# Altium project yard-ice.PrjPCB
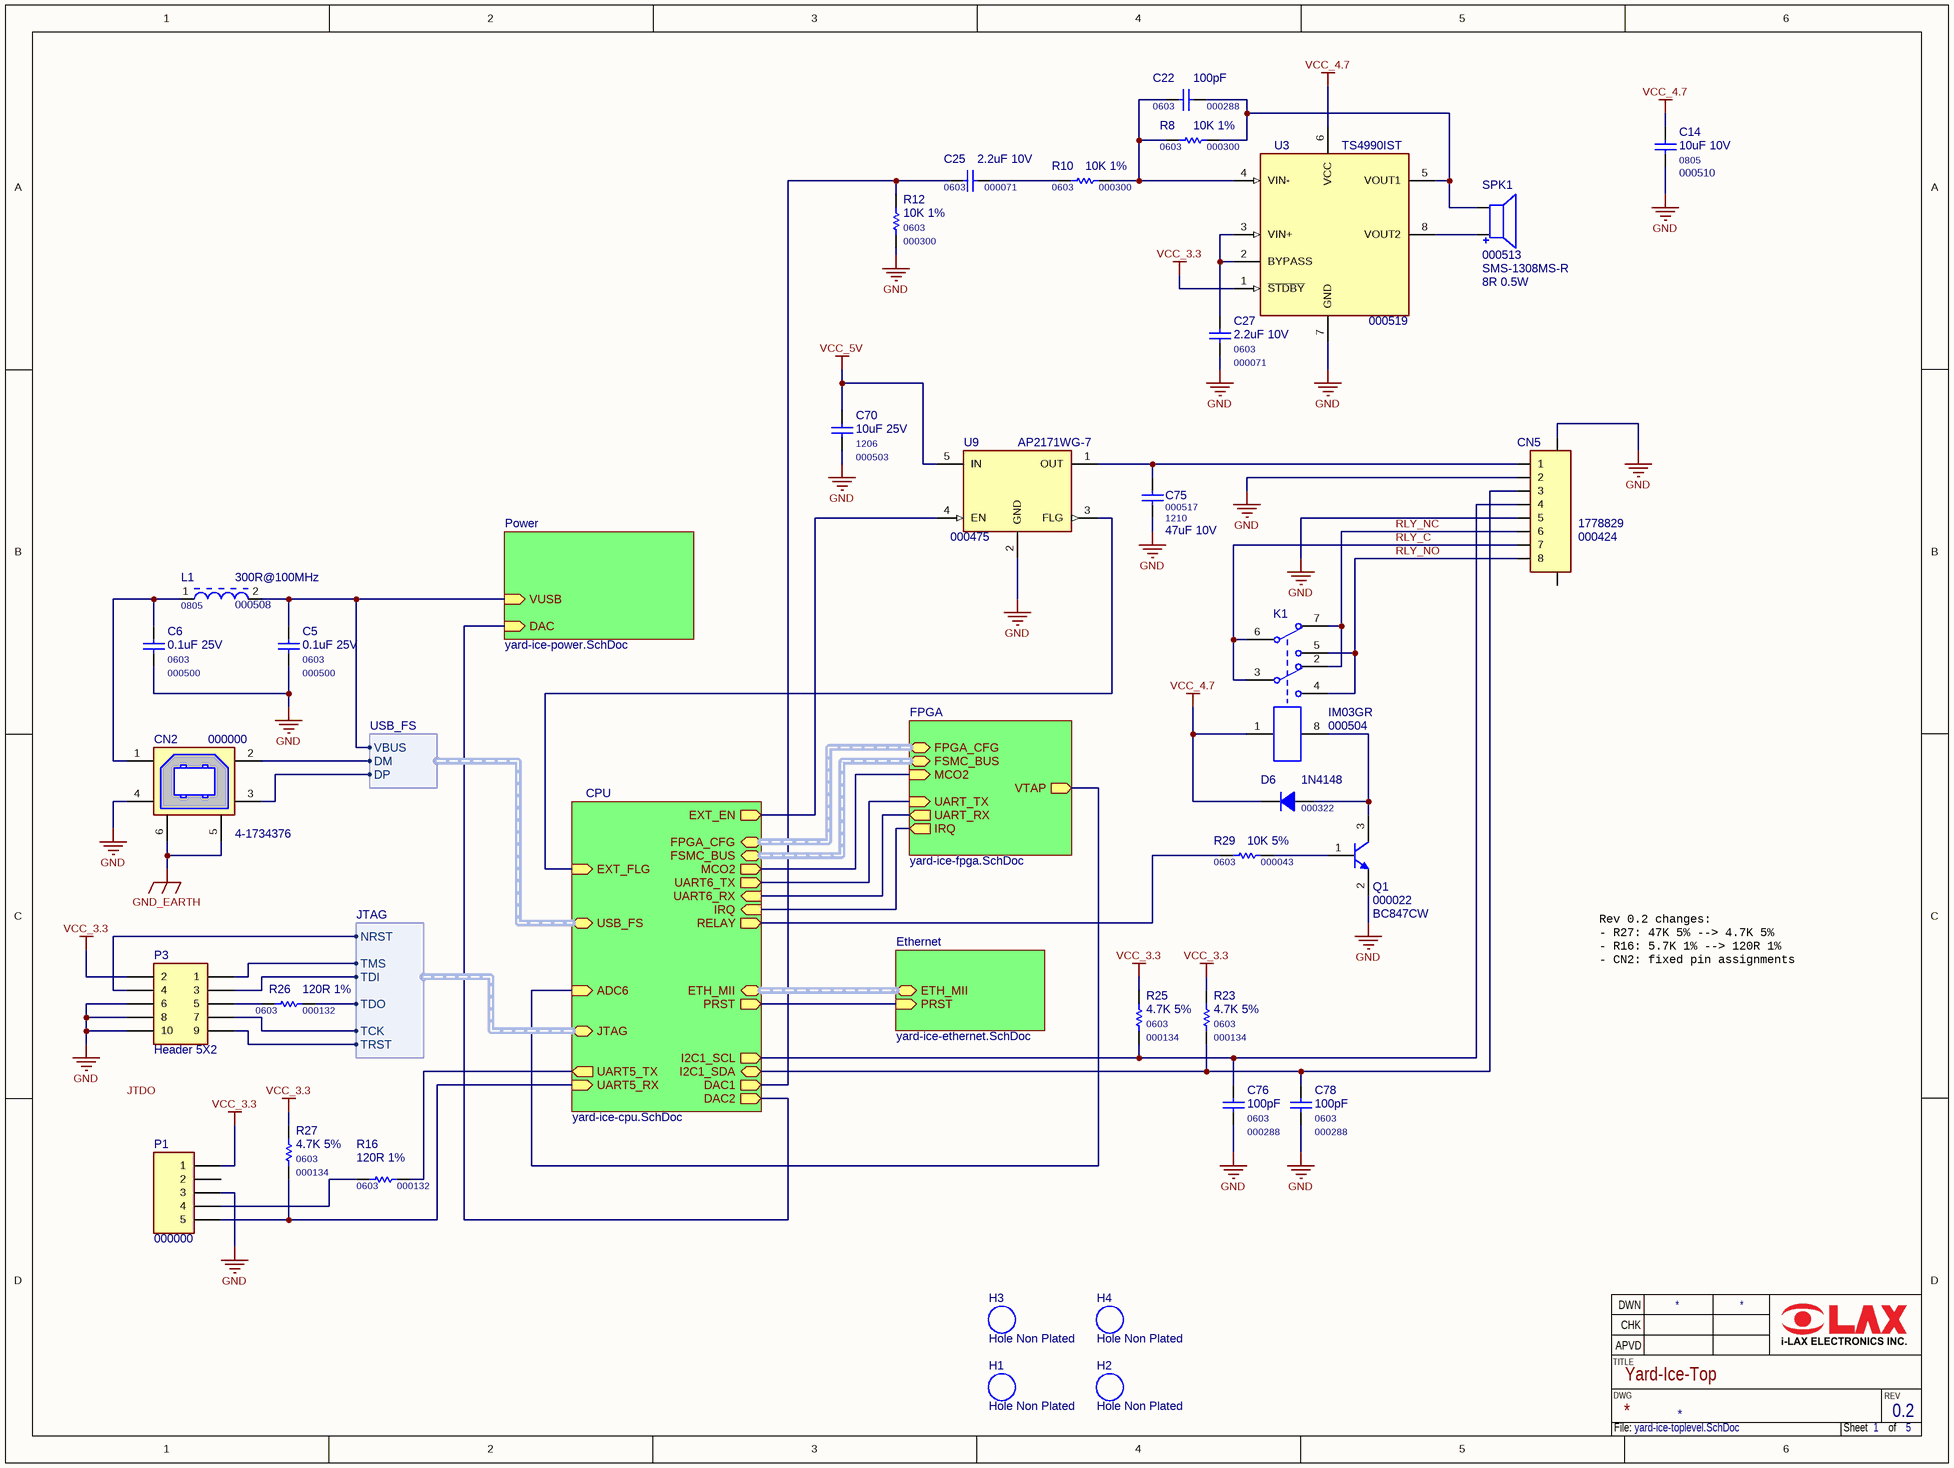
[diagram p0: yard-ice-toplevel.SchDoc]
4 sheets, 143 parts. Net scope: hierarchical (ports join the sheet entries above them; power ports are global).
Board file: yard-ice.PcbDoc
Sheets:
  yard-ice-toplevel.SchDoc
    Power = yard-ice-power.SchDoc
    FPGA = yard-ice-fpga.SchDoc
    Ethernet = yard-ice-ethernet.SchDoc

## Sheet yard-ice-toplevel.SchDoc: Yard-Ice-Top
size 365 x 274 mm; Revision: 0.2; SheetNumber: 1; SheetTotal: 5

### Parts
C5  000500  value 0.1uF 25V  Package: 0603  [C0603M]
C6  000500  value 0.1uF 25V  Package: 0603  [C0603M]
C14  000510  value 10uF 10V  Package: 0805  [C0805M]
C22  000288  value 100pF  Package: 0603  [C0603M]
C25  000071  value 2.2uF 10V  Package: 0603  [C0603M]
C27  000071  value 2.2uF 10V  Package: 0603  [C0603M]
C70  000503  value 10uF 25V  Package: 1206  [C1206M]
C75  000517  value 47uF 10V  Package: 1210  [C1210M]
C76  000288  value 100pF  Package: 0603  [C0603M]
C78  000288  value 100pF  Package: 0603  [C0603M]
CN2  000000  value 4-1734376  [4-1734376]
CN5  000424  value 1778829  [1778829]
D6  000322  value 1N4148  [SOD-123]
H1  Hole Non Plated  [Hole NP 3.2x5.0x5.0]
H2  Hole Non Plated  [Hole NP 3.2x5.0x5.0]
H3  Hole Non Plated  [Hole NP 3.2x5.0x5.0]
H4  Hole Non Plated  [Hole NP 3.2x5.0x5.0]
K1  000504  value IM03GR  [Relay-10X6]
L1  000508  value 300R@100MHz  Package: 0805  [L0805M]
P1  000000  [TSW-105-07-G-S]
P3  Header 5X2  [TSW-105-07-G-D]
Q1  000022  value BC847CW  [SOT-323]
R8  000300  value 10K 1%  Package: 0603  [R0603M]
R10  000300  value 10K 1%  Package: 0603  [R0603M]
R12  000300  value 10K 1%  Package: 0603  [R0603M]
R16  000132  value 120R 1%  Package: 0603  [R0603M]
R23  000134  value 4.7K 5%  Package: 0603  [R0603M]
R25  000134  value 4.7K 5%  Package: 0603  [R0603M]
R26  000132  value 120R 1%  Package: 0603  [R0603M]
R27  000134  value 4.7K 5%  Package: 0603  [R0603M]
R29  000043  value 10K 5%  Package: 0603  [R0603M]
SPK1  000513  value 8R 0.5W  [SMS-1308MS-R]
U3  000519  value TS4990IST  [MiniSO-8M]
U9  000475  value AP2171WG-7  [SOT-25]

### Sub-sheets
CPU = yard-ice-cpu.SchDoc (file not in this document): ETH_MII (harness ETH_MII), FSMC_BUS (harness FSMC_BUS), FPGA_CFG (harness FPGA_CFG), PRST (out), MCO2 (out), USB_FS (harness USB_FS), JTAG (harness JTAG), EXT_EN (out), EXT_FLG (in), ADC6 (in), DAC2 (out), I2C1_SDA (bidir), I2C1_SCL (out), UART6_TX (out), UART6_RX (in), UART5_TX (out), UART5_RX (in), RELAY (out), IRQ (in), DAC1 (out)
Ethernet = yard-ice-ethernet.SchDoc: ETH_MII (harness ETH_MII), PRST (in)
FPGA = yard-ice-fpga.SchDoc: FSMC_BUS (harness FSMC_BUS), FPGA_CFG (harness FPGA_CFG), MCO2 (in), VTAP (out), UART_TX (in), UART_RX (out), IRQ (out)
Power = yard-ice-power.SchDoc: VUSB (in), DAC (in)

### Harnesses
USB_FS: VBUS, DM, DP
JTAG: TDO, TDI, TCK, TMS, TRST, NRST

### Nets
GND: C5.2 C6.2 C14.2 C27.2 C70.2 C75.2 C76.2 C78.2 CN2.4 CN5.2 CN5.5 CN5.9 P1.3 P3.6 P3.8 P3.10 Q1.2(E) R12.1 U3.7(GND) U9.2(GND)
GND_EARTH: CN2.5(SHIELD) CN2.6(SHIELD)
VCC_3.3: P1.1 P3.2 R23.2 R25.2 R27.2 U3.1(~{STDBY})
VCC_4.7: C14.1 D6.2(K) K1.1 U3.6(VCC)
VCC_5V: C70.1 U9.5(IN)
RLY_C: CN5.7 K1.3 K1.6
RLY_NC: CN5.6 K1.2 K1.7
RLY_NO: CN5.8 K1.4 K1.5
NetC5_1: C5.1 L1.2 ; sheet Power/VUSB, sheet CPU/USB_FS.VBUS
NetC6_1: C6.1 CN2.1 L1.1
NetC22_1: C22.1 R8.2 R10.1 U3.4(VIN-)
NetC22_2: C22.2 R8.1 SPK1.2 U3.5(VOUT1)
NetC25_1: C25.1 R12.2 ; sheet CPU/DAC1
NetC25_2: C25.2 R10.2
NetC27_1: C27.1 U3.2(BYPASS) U3.3(VIN+)
NetC69_1: sheet Power/DAC, sheet CPU/DAC2
NetC72_1: sheet CPU/ADC6, sheet FPGA/VTAP
NetC75_1: C75.1 CN5.1 U9.1(OUT)
NetC76_1: C76.1 CN5.4 R25.1 ; sheet CPU/I2C1_SCL
NetC78_1: C78.1 CN5.3 R23.1 ; sheet CPU/I2C1_SDA
NetCN2_2: CN2.2 ; sheet CPU/USB_FS.DM
NetCN2_3: CN2.3 ; sheet CPU/USB_FS.DP
NetD6_1: D6.1(A) K1.8 Q1.3(C)
NetP1_4: P1.4 R16.2
NetP1_5: P1.5 R27.1 ; sheet CPU/UART5_RX
NetP3_1: P3.1 ; sheet CPU/JTAG.TMS
NetP3_3: P3.3 ; sheet CPU/JTAG.TDI
NetP3_4: P3.4 ; sheet CPU/JTAG.NRST
NetP3_5: P3.5 R26.1
NetP3_7: P3.7 ; sheet CPU/JTAG.TCK
NetP3_9: P3.9 ; sheet CPU/JTAG.TRST
NetQ1_1: Q1.1(B) R29.1
NetR16_1: R16.1 ; sheet CPU/UART5_TX
NetR26_2: R26.2 ; sheet CPU/JTAG.TDO
NetR28_2: sheet CPU/MCO2, sheet FPGA/MCO2
NetR29_2: R29.2 ; sheet CPU/RELAY
NetSPK1_1: SPK1.1 U3.8(VOUT2)
NetU4_47: sheet CPU/PRST, sheet Ethernet/PRST
NetU7_51: sheet CPU/UART6_RX, sheet FPGA/UART_RX
NetU7_52: sheet CPU/UART6_TX, sheet FPGA/UART_TX
NetU7_53: sheet CPU/IRQ, sheet FPGA/IRQ
NetU9_3: U9.3(FLG) ; sheet CPU/EXT_FLG
NetU9_4: U9.4(EN) ; sheet CPU/EXT_EN

Not connected (* = marked no-connect by the designer): CN5 10; P1 2

### Buses and harness runs
harness sheet CPU/ETH_MII = sheet Ethernet/ETH_MII
harness sheet CPU/FPGA_CFG = sheet FPGA/FPGA_CFG
harness sheet CPU/FSMC_BUS = sheet FPGA/FSMC_BUS

### Notes on the sheet
- Rev 0.2 changes:
  - R27: 47K 5% --> 4.7K 5%
  - R16: 5.7K 1% --> 120R 1%
  - CN2: fixed pin assignments
- Labels drawn without touching a wire or pin: JTDO
- TITLE
- APVD
- DWN
- CHK
- DWG
- REV
- File:
- Sheet
- of

### Library data of the parts
C5 C6 = C0603: SMD Ceramic Chip Capacitor - 0603 - X7R; MF PN: C1608X7R1E104K; MF: TDK; PN: 000500
C14 = C0805: SMD Ceramic Chip Capacitor - 0805 - X7R; MF PN: C2012X7R1A106K; MF: TDK; PN: 000510
C22 C76 C78 = C0603: SMD Ceramic Chip Capacitor - 0603; PN: 000288
C25 = C0603: SMD Ceramic Chip Capacitor - 0603 - X7R; MF PN: LMK107B7225KA-T; MF: Taiyo Yuden; PN: 000071
C27 = C0603: SMD Ceramic Chip Capacitor - 0603 - X7R; MF: Taiyo Yuden; MF PN: LMK107B7225KA-T; PN: 000071
C70 = C1206: SMD Ceramic Chip Capacitor - 1206 - X7R; MF PN: TMK316B7106KL-TD; MF: Taiyo Yuden; PN: 000503
C75 = C12010: SMD Ceramic Chip Capacitor - 1210 - X7R; MF: Taiyo Yuden; MF PN: LMK325B7476MM-TR; PN: 000517
CN2 = 4-1734376: USB Type B - Right Angle - Thru Hole; MF: Tyco; PN: 000000; Package: PTH
CN5 = Combicon SMT 8: Terminal Block, Header, 8-Pos; MF: Phoenix Contacts; PN: 000424; Package: SMT
D6 = 1N4148W: Schottky Barrier Diode; MF: Diodes Inc; MF PN: 1N4148W-7-F; PN: 000322; Package: SOD-123
K1 = Relay-DPDT: Dual-Pole Dual-Throw Relay; MF: Tyco; PN: 000504; Package: SMT; MF PN: IM03GR
L1 = L0805: SMD Chip Inductor - 0805; MF PN: MMZ2012Y301B; MF: TDK; PN: 000508
P1 = Header 5: Header, 5-Pin; Value: 5x1; PN: 000000; Package: PTH
P3 = Header 5X2: Header 5-Pin, Dual row; PN: 000000; Package: PTH; Value: 5x2
Q1 = BC847CW: NPN General-purpose Transistor; MF: Diodes Inc; MF PN: BC847CW-7-F; PN: 000022; Package: SOT-323
R8 R10 R12 R16 R23 R25-R27 R29 = R0603: SMD Chip Resistor - 0603
  R8 R10 R12: PN: 000300
  R16 R26: PN: 000132
  R23 R25 R27: PN: 000134
  R29: PN: 000043
SPK1 = SMS-1308MS-R: Loudspeaker; MF: PUI-Audio; PN: 000513; Package: SMT; MF PN: SMS-1308MS-R
U3 = TS4990IST: 1.2 W audio power amplifier with active-low standby mode; PN: 000519; Package: TSSOP-8
U9 = AP2171W: 1A SINGLE CHANNEL CURRENT-LIMITED POWER  SWITCH; MF: Diodes Inc; Package: SOT23-5; PN: 000475

## Sheet yard-ice-power.SchDoc: Yard-Ice-Power
size 365 x 274 mm; Revision: 0.2; SheetNumber: 2; SheetTotal: 5
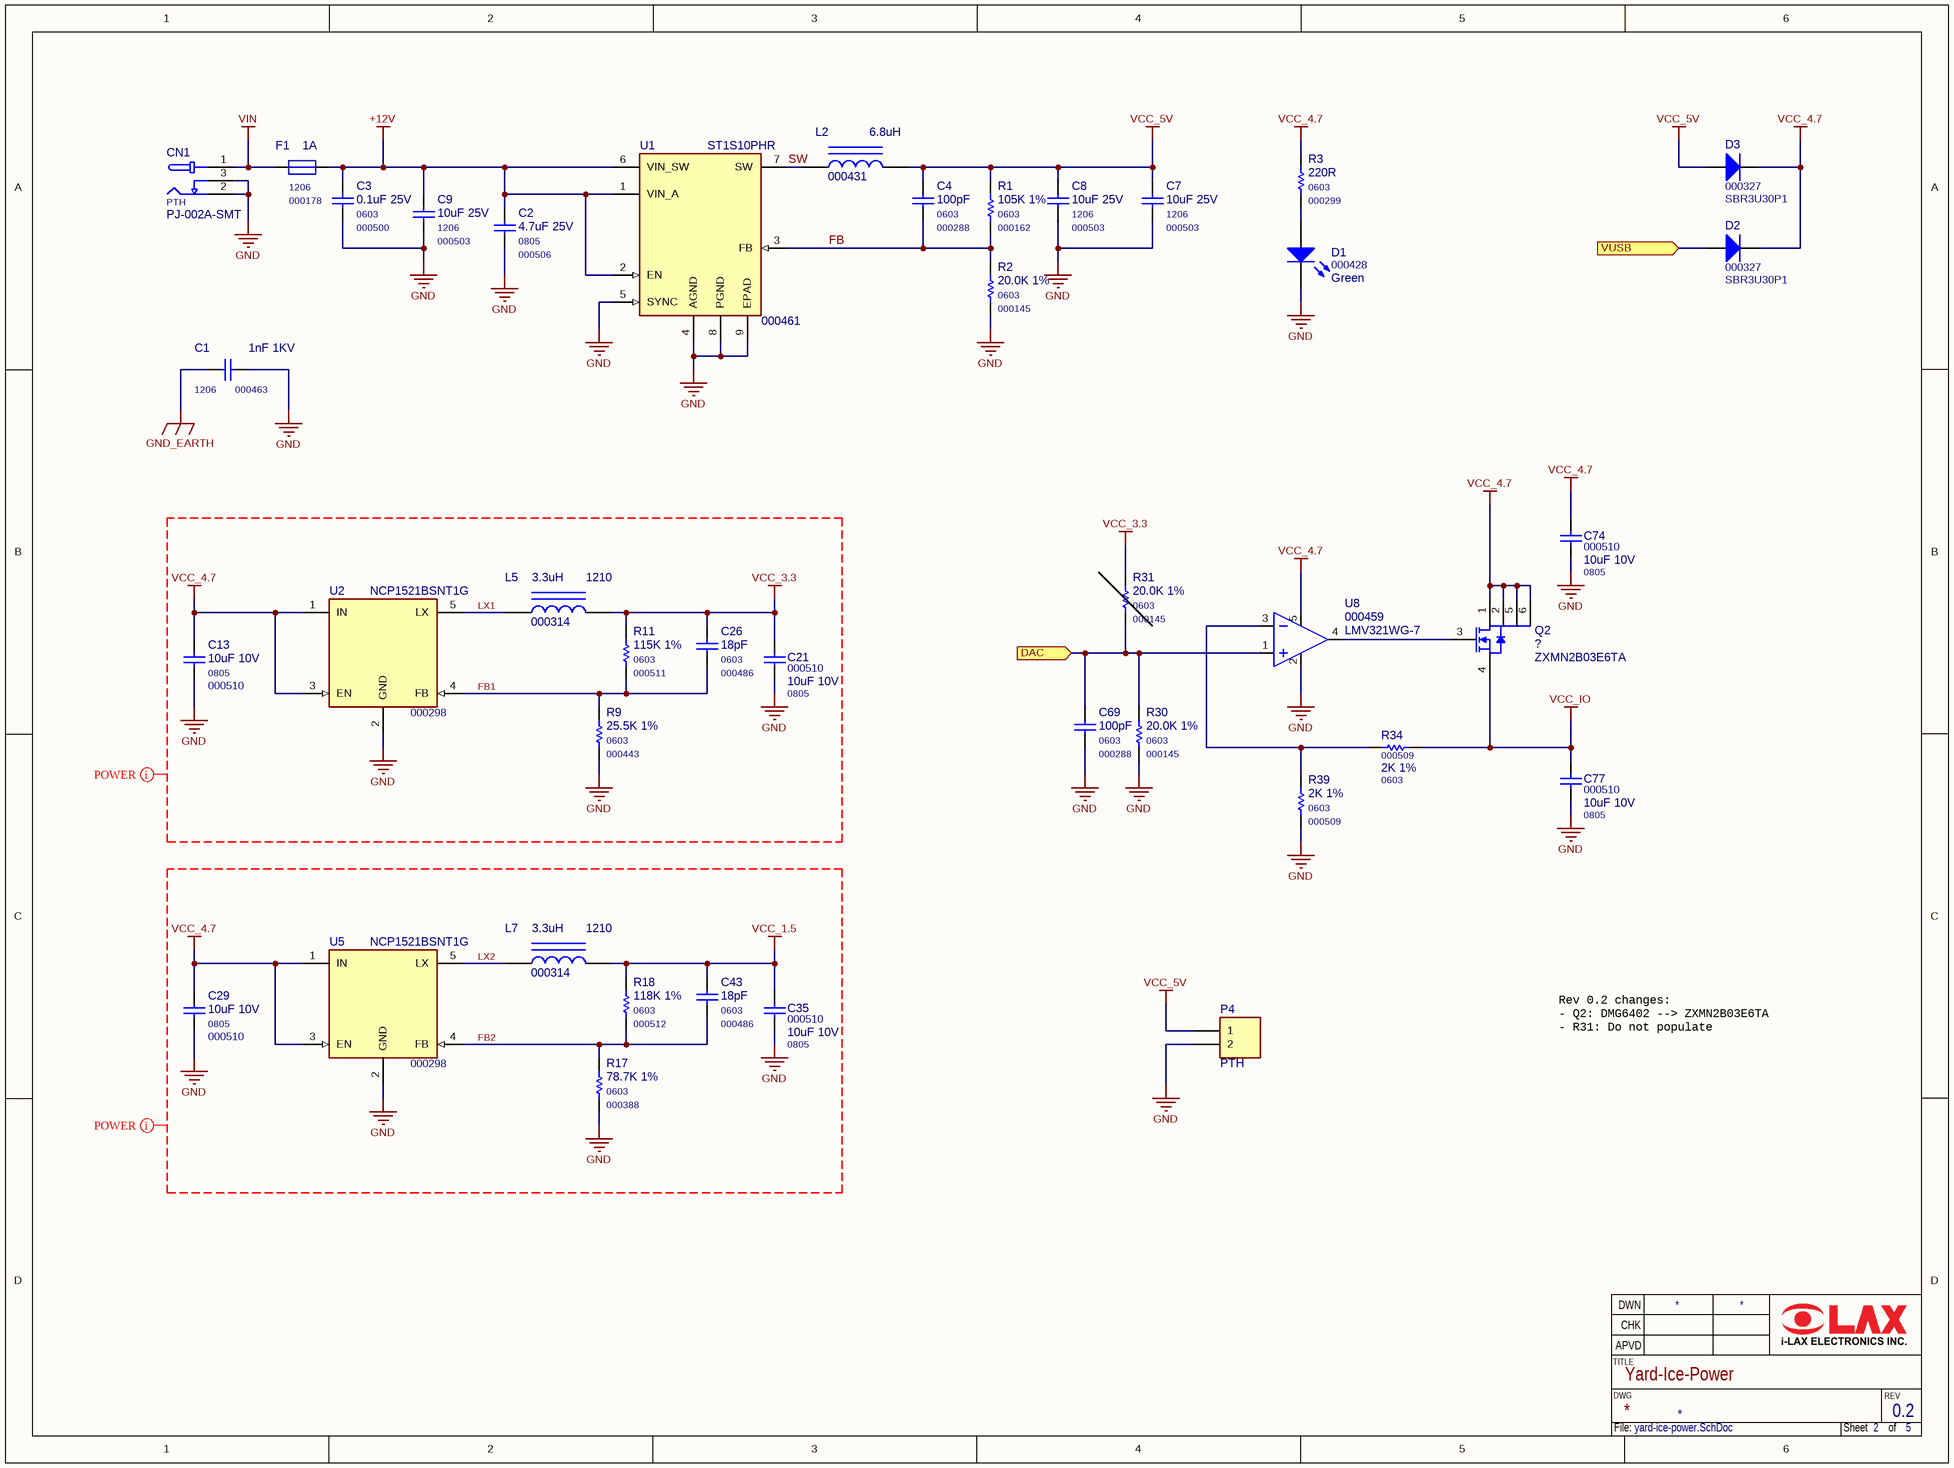
[diagram p1: yard-ice-power.SchDoc]

### Parts
C1  000463  value 1nF 1KV  Package: 1206  [C1206M]
C2  000506  value 4.7uF 25V  Package: 0805  [C0805M]
C3  000500  value 0.1uF 25V  Package: 0603  [C0603M]
C4  000288  value 100pF  Package: 0603  [C0603M]
C7  000503  value 10uF 25V  Package: 1206  [C1206M]
C8  000503  value 10uF 25V  Package: 1206  [C1206M]
C9  000503  value 10uF 25V  Package: 1206  [C1206M]
C13  000510  value 10uF 10V  Package: 0805  [C0805M]
C21  000510  value 10uF 10V  Package: 0805  [C0805M]
C26  000486  value 18pF  Package: 0603  [C0603M]
C29  000510  value 10uF 10V  Package: 0805  [C0805M]
C35  000510  value 10uF 10V  Package: 0805  [C0805M]
C43  000486  value 18pF  Package: 0603  [C0603M]
C69  000288  value 100pF  Package: 0603  [C0603M]
C74  000510  value 10uF 10V  Package: 0805  [C0805M]
C77  000510  value 10uF 10V  Package: 0805  [C0805M]
CN1  PTH  [PJ-002A-SMT]
D1  000428  value Green  [LED0805L LP]
D2  000327  value SBR3U30P1  [PowerDI 123]
D3  000327  value SBR3U30P1  [PowerDI 123]
F1  000178  value 1A  Package: 1206  [F1206L]
L2  000431  value 6.8uH  [L8.0MMX8.0MM]
L5  000314  value 3.3uH  Package: 1210  [L1210M]
L7  000314  value 3.3uH  Package: 1210  [L1210M]
P4  PTH  [TSW-102-07-G-S]
Q2  ?  value ZXMN2B03E6TA  [SOT-26]
R1  000162  value 105K 1%  Package: 0603  [R0603M]
R2  000145  value 20.0K 1%  Package: 0603  [R0603M]
R3  000299  value 220R  Package: 0603  [R0603M]
R9  000443  value 25.5K 1%  Package: 0603  [R0603M]
R11  000511  value 115K 1%  Package: 0603  [R0603M]
R17  000388  value 78.7K 1%  Package: 0603  [R0603M]
R18  000512  value 118K 1%  Package: 0603  [R0603M]
R30  000145  value 20.0K 1%  Package: 0603  [R0603M]
R31  000145  value 20.0K 1%  Package: 0603  [R0603M]
R34  000509  value 2K 1%  Package: 0603  [R0603M]
R39  000509  value 2K 1%  Package: 0603  [R0603M]
U1  000461  value ST1S10PHR  [PowerSO-8]
U2  000298  value NCP1521BSNT1G  [TSOP-5]
U5  000298  value NCP1521BSNT1G  [TSOP-5]
U8  000459  value LMV321WG-7  [SOT-25]

### Ports
DAC (in), VUSB (in)

### Nets
+12V: C2.1 C3.1 C9.1 F1.2 U1.1(VIN_A) U1.2(EN) U1.6(VIN_SW)
GND: C1.2 C2.2 C3.2 C7.2 C8.2 C9.2 C13.2 C21.2 C29.2 C35.2 C69.2 C74.2 C77.2 CN1.2 CN1.3 D1.2(K) P4.2 R2.1 R9.1 R17.1 R30.1 R39.1 U1.4(AGND) U1.5(SYNC) U1.8(PGND) U1.9(EPAD) U2.2(GND) U5.2(GND) U8.2(V-)
GND_EARTH: C1.1
VCC_1.5: C35.1 C43.1 L7.2 R18.2
VCC_3.3: C21.1 C26.1 L5.2 R11.2 R31.2
VCC_4.7: C13.1 C29.1 C74.1 D2.2(K) D3.2(K) Q2.1(D) Q2.2(D) Q2.5(D) Q2.6(D) R3.2 U2.1(IN) U2.3(EN) U5.1(IN) U5.3(EN) U8.5(V+)
VCC_5V: C4.1 C7.1 C8.1 D3.1(A) L2.2 P4.1 R1.2
VCC_IO: C77.1 Q2.4(S) R34.1
VIN: CN1.1 F1.1
FB: C4.2 R1.1 R2.2 U1.3(FB)
FB1: C26.2 R9.2 R11.1 U2.4(FB)
FB2: C43.2 R17.2 R18.1 U5.4(FB)
LX1: L5.1 U2.5(LX)
LX2: L7.1 U5.5(LX)
SW: L2.1 U1.7(SW)
NetC5_1: D2.1(A) ; port VUSB
NetC69_1: C69.1 R30.2 R31.1 U8.1(IN+) ; port DAC
NetD1_1: D1.1(A) R3.1
NetQ2_3: Q2.3(G) U8.4(OUT)
NetR34_2: R34.2 R39.2 U8.3(IN-)

### Layout directives
net class POWER: FB1, FB2, GND, LX1, LX2, VCC_1.5, VCC_3.3, VCC_4.7

### Notes on the sheet
- Rev 0.2 changes:
  - Q2: DMG6402 --> ZXMN2B03E6TA
  - R31: Do not populate
- TITLE
- APVD
- DWN
- CHK
- DWG
- REV
- File:
- Sheet
- of

### Library data of the parts
C1 = C1206: SMD Ceramic Chip Capacitor - 1206; PN: 000463
C2 = C0805: SMD Ceramic Chip Capacitor - 0805 - X7R; MF: Taiyo Yuden; MF PN: TMK212AB7475KG-T; PN: 000506
C3 = C0603: as C5 on sheet yard-ice-toplevel; PN: 000500
C4 C26 C43 C69 = C0603: SMD Ceramic Chip Capacitor - 0603
  C4 C69: PN: 000288
  C26 C43: PN: 000486
C7-C9 = C1206: as C70 on sheet yard-ice-toplevel; PN: 000503
C13 C21 C29 C35 = C0805: as C14 on sheet yard-ice-toplevel; PN: 000510
C74 C77 = C0805: SMD Ceramic Chip Capacitor - 0805 - X7R; MF PN: C2012X7R1A106K; PN: TDK; PN: 000510; MF: TDK
CN1 = PJ-002A-SMT: Low Voltage Power Supply Connector; MF: CUI INC; PN: PTH; MF PN: PJ-002A-SMT; Package: SMT; Value: PJ-002A-SMT
D1 = LED0805LP: LED SMD 0805; Package: 0805; PN: 000428
D2 D3 = SBR3U30P1: Super Barrier Rectifier; MF: Diodes Inc; PN: 000327; Package: PowerDI 123
F1 = F1206: SMD Fuse, 1A, Slow, 63VDC, 1206; MF: Bel Fuse Inc; MF PN: C1S 1; PN: 000178
L2 = L8.0X8.0: SMT Power Inductor 8.0X8.0mm; MF: Taiyo Yuden; MF PN: NRS8040T6R8NJGJ; PN: 000431; Package: 8.0x8.0mm
L5 L7 = L1210: SMD Wire Wound Inductor -  1210 (3225 metric); MF: Murata; MF PN: LQH32PN3R3NN0L; PN: 000314
P4 = Header 2: Header, 2-Pin; Value: 2x1; PN: PTH; Package: PTH
Q2 = ZXMN10A08E6: N-Channel MOSFET, 30V, 5.3A; MF: Diodes Inc.; MF PN: DMG6402LDM-7; PN: ?; Package: SOT23-6
R1-R3 R9 R11 R17 R18 R30 R31 R34 R39 = R0603: SMD Chip Resistor - 0603
  R1: PN: 000162
  R2 R30 R31: PN: 000145
  R3: PN: 000299
  R9: PN: 000443
  R11: PN: 000511
  R17: PN: 000388
  R18: PN: 000512
  R34 R39: PN: 000509
U1 = ST1S10: 3A, 900kHZ, monolithic synchronous step-down regulator; MF: ST; PN: 000461; Package: SOIC-8
U2 U5 = NCP1521BSNT1G: 1.5 MHz, 600 mA Step-Down  DC-DC Converter; MF: ON Semiconductor; PN: 000298; Package: SOT-23-5
U8 = LMV321WG-7: General Purpose, Low Voltage, Rail-to-Rail Output Operational Amplifier; MF: Diodes Inc; Package: SOT25; PN: 000459

## Sheet yard-ice-fpga.SchDoc: Yard-Ice-FPGA
size 365 x 274 mm; Revision: 0.2; SheetNumber: 4; SheetTotal: 5
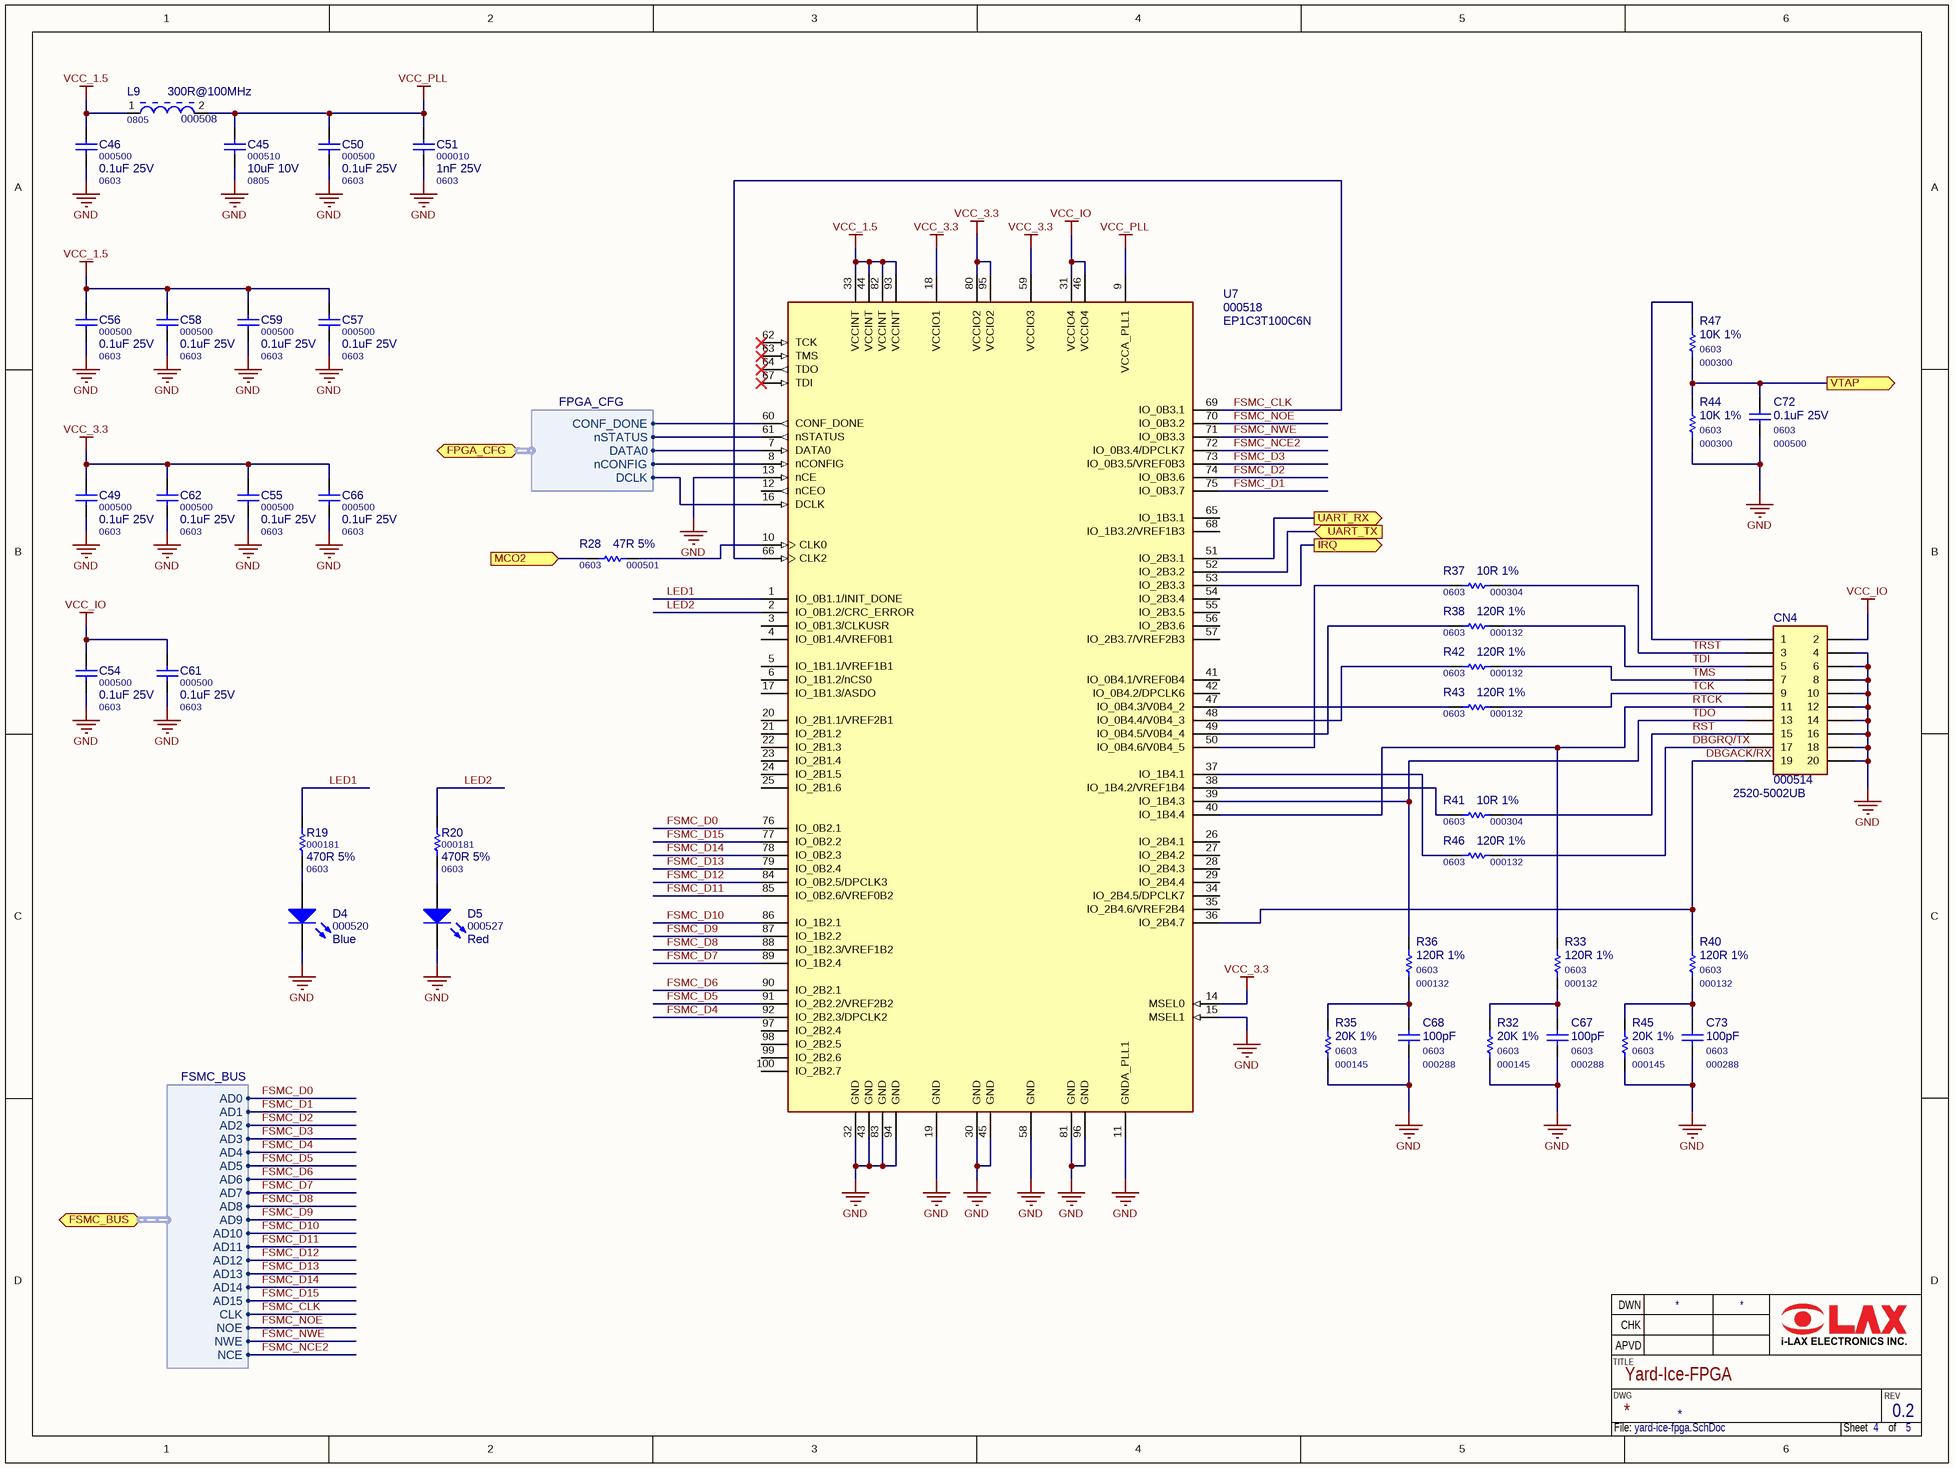
[diagram p2: yard-ice-fpga.SchDoc]

### Parts
C45  000510  value 10uF 10V  Package: 0805  [C0805M]
C46  000500  value 0.1uF 25V  Package: 0603  [C0603M]
C49  000500  value 0.1uF 25V  Package: 0603  [C0603M]
C50  000500  value 0.1uF 25V  Package: 0603  [C0603M]
C51  000010  value 1nF 25V  Package: 0603  [C0603M]
C54  000500  value 0.1uF 25V  Package: 0603  [C0603M]
C55  000500  value 0.1uF 25V  Package: 0603  [C0603M]
C56  000500  value 0.1uF 25V  Package: 0603  [C0603M]
C57  000500  value 0.1uF 25V  Package: 0603  [C0603M]
C58  000500  value 0.1uF 25V  Package: 0603  [C0603M]
C59  000500  value 0.1uF 25V  Package: 0603  [C0603M]
C61  000500  value 0.1uF 25V  Package: 0603  [C0603M]
C62  000500  value 0.1uF 25V  Package: 0603  [C0603M]
C66  000500  value 0.1uF 25V  Package: 0603  [C0603M]
C67  000288  value 100pF  Package: 0603  [C0603M]
C68  000288  value 100pF  Package: 0603  [C0603M]
C72  000500  value 0.1uF 25V  Package: 0603  [C0603M]
C73  000288  value 100pF  Package: 0603  [C0603M]
CN4  000514  value 2520-5002UB  [TST-110-04-G-D-RA]
D4  000520  value Blue  [LED0805L LP]
D5  000527  value Red  [LED0805L LP]
L9  000508  value 300R@100MHz  Package: 0805  [L0805M]
R19  000181  value 470R 5%  Package: 0603  [R0603M]
R20  000181  value 470R 5%  Package: 0603  [R0603M]
R28  000501  value 47R 5%  Package: 0603  [R0603M]
R32  000145  value 20K 1%  Package: 0603  [R0603M]
R33  000132  value 120R 1%  Package: 0603  [R0603M]
R35  000145  value 20K 1%  Package: 0603  [R0603M]
R36  000132  value 120R 1%  Package: 0603  [R0603M]
R37  000304  value 10R 1%  Package: 0603  [R0603M]
R38  000132  value 120R 1%  Package: 0603  [R0603M]
R40  000132  value 120R 1%  Package: 0603  [R0603M]
R41  000304  value 10R 1%  Package: 0603  [R0603M]
R42  000132  value 120R 1%  Package: 0603  [R0603M]
R43  000132  value 120R 1%  Package: 0603  [R0603M]
R44  000300  value 10K 1%  Package: 0603  [R0603M]
R45  000145  value 20K 1%  Package: 0603  [R0603M]
R46  000132  value 120R 1%  Package: 0603  [R0603M]
R47  000300  value 10K 1%  Package: 0603  [R0603M]
U7  000518  value EP1C3T100C6N  [TQFP-100]

### Ports
FPGA_CFG (harness FPGA_CFG), FSMC_BUS (harness FSMC_BUS), IRQ (out), MCO2 (in), UART_RX (out), UART_TX (in), VTAP (out)

### Harnesses
FSMC_BUS: AD0, AD1, AD2, AD3, AD4, AD5, AD6, AD7, AD8, AD9, AD10, AD11, AD12, AD13, AD14, AD15, CLK, NOE, NWE, NCE
FPGA_CFG: CONF_DONE, nSTATUS, DATA0, nCONFIG, DCLK

### Nets
GND: C45.2 C46.2 C49.2 C50.2 C51.2 C54.2 C55.2 C56.2 C57.2 C58.2 C59.2 C61.2 C62.2 C66.2 C67.2 C68.2 C72.2 C73.2 CN4.4 CN4.6 CN4.8 CN4.10 CN4.12 CN4.14 CN4.16 CN4.18 CN4.20 D4.2(K) D5.2(K) R32.2 R35.2 R44.2 R45.2 U7.11(GNDA_PLL1) U7.13(nCE) U7.15(MSEL1) U7.19(GND) U7.30(GND) U7.32(GND) U7.43(GND) U7.45(GND) U7.58(GND) U7.81(GND) U7.83(GND) U7.94(GND) U7.96(GND)
VCC_1.5: C46.1 C56.1 C57.1 C58.1 C59.1 L9.1 U7.33(VCCINT) U7.44(VCCINT) U7.82(VCCINT) U7.93(VCCINT)
VCC_3.3: C49.1 C55.1 C62.1 C66.1 U7.14(MSEL0) U7.18(VCCIO1) U7.59(VCCIO3) U7.80(VCCIO2) U7.95(VCCIO2)
VCC_IO: C54.1 C61.1 CN4.2 U7.31(VCCIO4) U7.46(VCCIO4)
VCC_PLL: C45.1 C50.1 C51.1 L9.2 U7.9(VCCA_PLL1)
DBGACK/RX: CN4.19 R40.1 U7.36(IO_2B4.7)
DBGRQ/TX: CN4.17 R46.1
FSMC_CLK: U7.66(CLK2) U7.69(IO_0B3.1) ; port FSMC_BUS.CLK
FSMC_D0: U7.76(IO_0B2.1) ; port FSMC_BUS.AD0
FSMC_D1: U7.75(IO_0B3.7) ; port FSMC_BUS.AD1
FSMC_D2: U7.74(IO_0B3.6) ; port FSMC_BUS.AD2
FSMC_D3: U7.73(IO_0B3.5/VREF0B3) ; port FSMC_BUS.AD3
FSMC_D4: U7.92(IO_2B2.3/DPCLK2) ; port FSMC_BUS.AD4
FSMC_D5: U7.91(IO_2B2.2/VREF2B2) ; port FSMC_BUS.AD5
FSMC_D6: U7.90(IO_2B2.1) ; port FSMC_BUS.AD6
FSMC_D7: U7.89(IO_1B2.4) ; port FSMC_BUS.AD7
FSMC_D8: U7.88(IO_1B2.3/VREF1B2) ; port FSMC_BUS.AD8
FSMC_D9: U7.87(IO_1B2.2) ; port FSMC_BUS.AD9
FSMC_D10: U7.86(IO_1B2.1) ; port FSMC_BUS.AD10
FSMC_D11: U7.85(IO_0B2.6/VREF0B2) ; port FSMC_BUS.AD11
FSMC_D12: U7.84(IO_0B2.5/DPCLK3) ; port FSMC_BUS.AD12
FSMC_D13: U7.79(IO_0B2.4) ; port FSMC_BUS.AD13
FSMC_D14: U7.78(IO_0B2.3) ; port FSMC_BUS.AD14
FSMC_D15: U7.77(IO_0B2.2) ; port FSMC_BUS.AD15
FSMC_NCE2: U7.72(IO_0B3.4/DPCLK7) ; port FSMC_BUS.NCE
FSMC_NOE: U7.70(IO_0B3.2) ; port FSMC_BUS.NOE
FSMC_NWE: U7.71(IO_0B3.3) ; port FSMC_BUS.NWE
LED1: R19.1 U7.1(IO_0B1.1/INIT_DONE)
LED2: R20.1 U7.2(IO_0B1.2/CRC_ERROR)
RST: CN4.15 R41.1
RTCK: CN4.11 R33.1 U7.40(IO_1B4.4)
TCK: CN4.9 R43.1
TDI: CN4.5 R38.1
TDO: CN4.13 R36.1 U7.39(IO_1B4.3)
TMS: CN4.7 R42.1
TRST: CN4.3 R37.1
NetC67_1: C67.1 R32.1 R33.2
NetC68_1: C68.1 R35.1 R36.2
NetC72_1: C72.1 R44.1 R47.2 ; port VTAP
NetC73_1: C73.1 R40.2 R45.1
NetCN4_1: CN4.1 R47.1
NetD4_1: D4.1(A) R19.2
NetD5_1: D5.1(A) R20.2
NetR28_1: R28.1 U7.10(CLK0)
NetR28_2: R28.2 ; port MCO2
NetR37_2: R37.2 U7.50(IO_0B4.6/V0B4_5)
NetR38_2: R38.2 U7.49(IO_0B4.5/V0B4_4)
NetR41_2: R41.2 U7.38(IO_1B4.2/VREF1B4)
NetR42_2: R42.2 U7.48(IO_0B4.4/V0B4_3)
NetR43_2: R43.2 U7.47(IO_0B4.3/V0B4_2)
NetR46_2: R46.2 U7.37(IO_1B4.1)
NetU7_7: U7.7(DATA0) ; port FPGA_CFG.DATA0
NetU7_8: U7.8(nCONFIG) ; port FPGA_CFG.nCONFIG
NetU7_16: U7.16(DCLK) ; port FPGA_CFG.DCLK
NetU7_51: U7.51(IO_2B3.1) ; port UART_RX
NetU7_52: U7.52(IO_2B3.2) ; port UART_TX
NetU7_53: U7.53(IO_2B3.3) ; port IRQ
NetU7_60: U7.60(CONF_DONE) ; port FPGA_CFG.CONF_DONE
NetU7_61: U7.61(nSTATUS) ; port FPGA_CFG.nSTATUS

Not connected (* = marked no-connect by the designer): U7 3(IO_0B1.3/CLKUSR) 4(IO_0B1.4/VREF0B1) 5(IO_1B1.1/VREF1B1) 6(IO_1B1.2/nCS0) 12(nCEO) 17(IO_1B1.3/ASDO) 20(IO_2B1.1/VREF2B1) 21(IO_2B1.2) 22(IO_2B1.3) 23(IO_2B1.4) 24(IO_2B1.5) 25(IO_2B1.6) 26(IO_2B4.1) 27(IO_2B4.2) 28(IO_2B4.3) 29(IO_2B4.4) 34(IO_2B4.5/DPCLK7) 35(IO_2B4.6/VREF2B4) 41(IO_0B4.1/VREF0B4) 42(IO_0B4.2/DPCLK6) 54(IO_2B3.4) 55(IO_2B3.5) 56(IO_2B3.6) 57(IO_2B3.7/VREF2B3) 62(TCK)* 63(TMS)* 64(TDO)* 65(IO_1B3.1) 67(TDI)* 68(IO_1B3.2/VREF1B3) 97(IO_2B2.4) 98(IO_2B2.5) 99(IO_2B2.6) 100(IO_2B2.7)

### Notes on the sheet
- TITLE
- APVD
- DWN
- CHK
- DWG
- REV
- File:
- Sheet
- of

### Library data of the parts
C45 = C0805: as C14 on sheet yard-ice-toplevel; PN: 000510
C46 C49 C50 C54-C59 C61 C62 C66 C72 = C0603: as C5 on sheet yard-ice-toplevel; PN: 000500
C51 = C0603: SMD Ceramic Chip Capacitor - 0603 - X7R; PN: 000010
C67 C68 C73 = C0603: SMD Ceramic Chip Capacitor - 0603; PN: 000288
CN4 = Header 10X2: Shrouded Header, 20 Pos, Right Angle; MF: 3M; PN: 000514; Package: PTH; MF PN: 2520-5002UB
D4 D5 = LED0805LP: LED SMD 0805; Package: 0805
  D4: PN: 000520
  D5: PN: 000527
L9 = L0805: SMD Ferrite Bead 0805; MF PN: MMZ2012Y301B; MF: TDK; PN: 000508
R19 R20 R28 R32 R33 R35-R38 R40-R47 = R0603: SMD Chip Resistor - 0603
  R19 R20: PN: 000181
  R28: PN: 000501
  R32 R35 R45: PN: 000145
  R33 R36 R38 R40 R42 R43 R46: PN: 000132
  R37 R41: PN: 000304
  R44 R47: PN: 000300
U7 = EP1C3T100C8N: Cyclone FPGA; MF: Altera; Package: 100-TQFP; PN: 000518; MF PN: EP1C3T100C6N

## Sheet yard-ice-ethernet.SchDoc: Yard-Ice-Ethernet
size 365 x 274 mm; Revision: 0.2; SheetNumber: 5; SheetTotal: 5
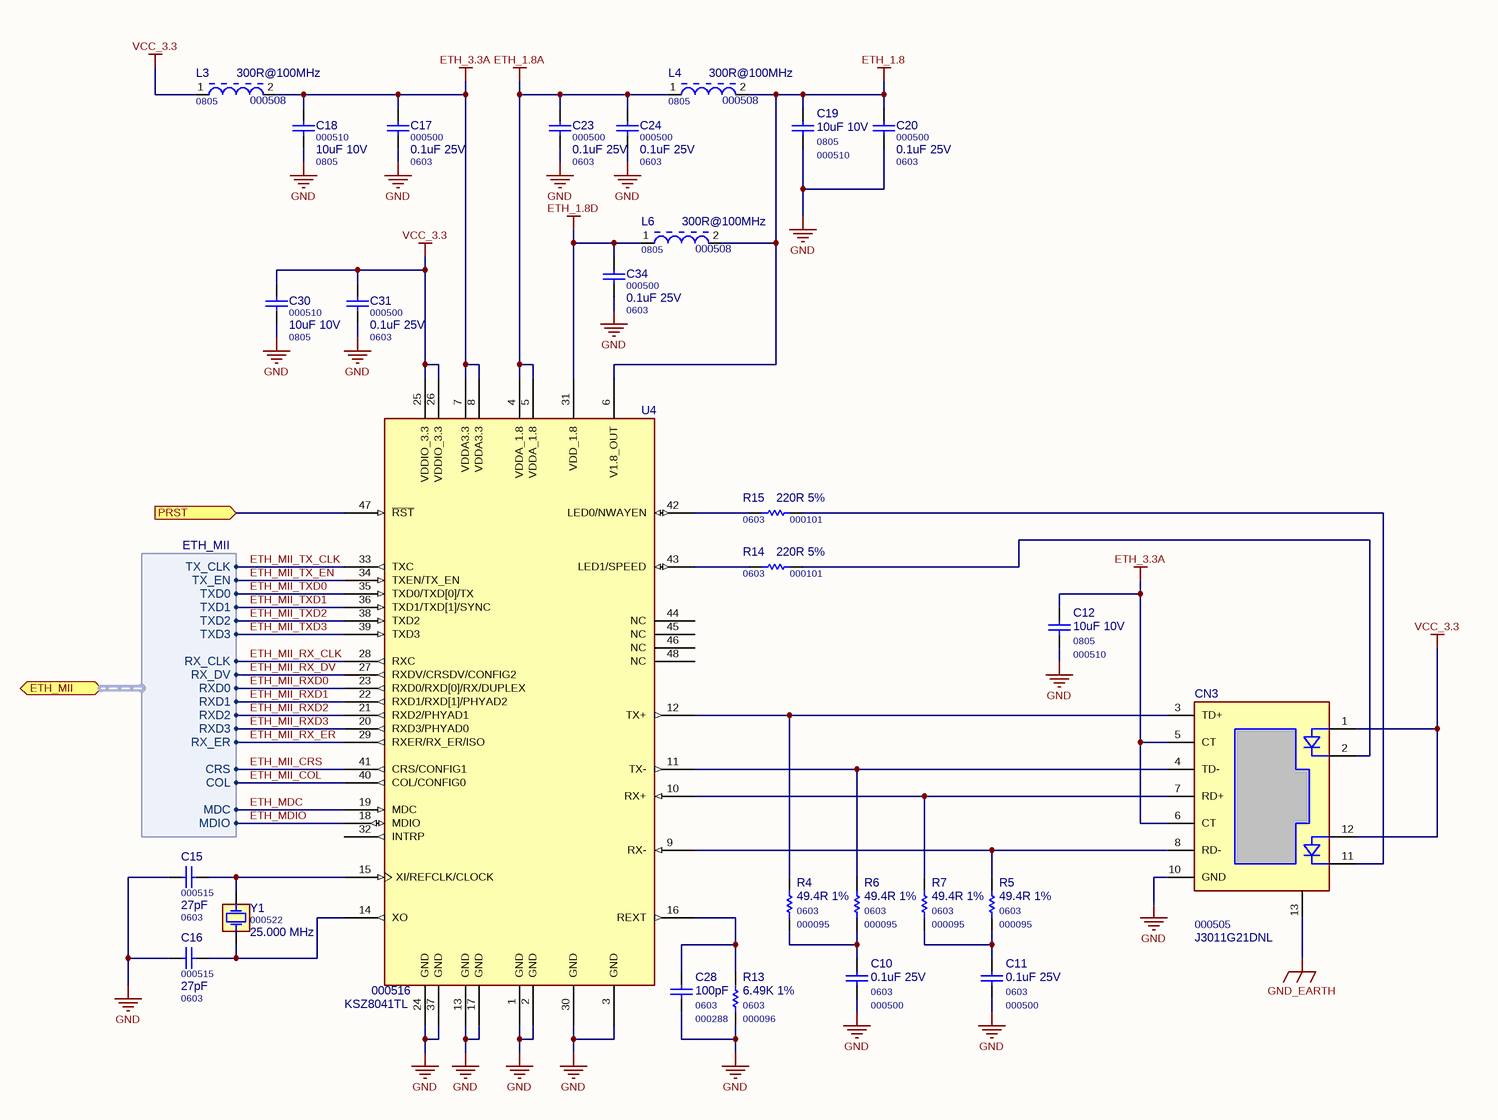
[diagram p3: yard-ice-ethernet.SchDoc]

### Parts
C10  000500  value 0.1uF 25V  Package: 0603  [C0603M]
C11  000500  value 0.1uF 25V  Package: 0603  [C0603M]
C12  000510  value 10uF 10V  Package: 0805  [C0805M]
C15  000515  value 27pF  Package: 0603  [C0603M]
C16  000515  value 27pF  Package: 0603  [C0603M]
C17  000500  value 0.1uF 25V  Package: 0603  [C0603M]
C18  000510  value 10uF 10V  Package: 0805  [C0805M]
C19  000510  value 10uF 10V  Package: 0805  [C0805M]
C20  000500  value 0.1uF 25V  Package: 0603  [C0603M]
C23  000500  value 0.1uF 25V  Package: 0603  [C0603M]
C24  000500  value 0.1uF 25V  Package: 0603  [C0603M]
C28  000288  value 100pF  Package: 0603  [C0603M]
C30  000510  value 10uF 10V  Package: 0805  [C0805M]
C31  000500  value 0.1uF 25V  Package: 0603  [C0603M]
C34  000500  value 0.1uF 25V  Package: 0603  [C0603M]
CN3  000505  value J3011G21DNL  [MOD-J3]
L3  000508  value 300R@100MHz  Package: 0805  [L0805M]
L4  000508  value 300R@100MHz  Package: 0805  [L0805M]
L6  000508  value 300R@100MHz  Package: 0805  [L0805M]
R4  000095  value 49.4R 1%  Package: 0603  [R0603M]
R5  000095  value 49.4R 1%  Package: 0603  [R0603M]
R6  000095  value 49.4R 1%  Package: 0603  [R0603M]
R7  000095  value 49.4R 1%  Package: 0603  [R0603M]
R13  000096  value 6.49K 1%  Package: 0603  [R0603M]
R14  000101  value 220R 5%  Package: 0603  [R0603M]
R15  000101  value 220R 5%  Package: 0603  [R0603M]
U4  000516  value KSZ8041TL  [48-TQFP]
Y1  000522  value 25.000 MHz  [ABM3-H]

### Ports
ETH_MII (harness ETH_MII), PRST (in)

### Harnesses
ETH_MII: TX_CLK, TX_EN, TXD0, TXD1, TXD2, TXD3, RX_CLK, RX_DV, RXD0, RXD1, RXD2, RXD3, RX_ER, CRS, COL, MDC, MDIO

### Nets
ETH_1.8: C19.1 C20.1 L4.2 L6.2 U4.6(V1.8_OUT)
ETH_1.8A: C23.1 C24.1 L4.1 U4.4(VDDA_1.8) U4.5(VDDA_1.8)
ETH_1.8D: C34.1 L6.1 U4.31(VDD_1.8)
ETH_3.3A: C12.1 C17.1 C18.1 CN3.5(CT) CN3.6(CT) L3.2 U4.7(VDDA3.3) U4.8(VDDA3.3)
GND: C10.2 C11.2 C12.2 C15.1 C16.1 C17.2 C18.2 C19.2 C20.2 C23.2 C24.2 C28.2 C30.2 C31.2 C34.2 CN3.10(GND) R13.1 U4.1(GND) U4.2(GND) U4.3(GND) U4.13(GND) U4.17(GND) U4.24(GND) U4.30(GND) U4.37(GND)
GND_EARTH: CN3.13(SHIELD)
VCC_3.3: C30.1 C31.1 CN3.1(A2) CN3.12(A1) L3.1 U4.25(VDDIO_3.3) U4.26(VDDIO_3.3)
ETH_MDC: U4.19(MDC) ; port ETH_MII.MDC
ETH_MDIO: U4.18(MDIO) ; port ETH_MII.MDIO
ETH_MII_COL: U4.40(COL/CONFIG0) ; port ETH_MII.COL
ETH_MII_CRS: U4.41(CRS/CONFIG1) ; port ETH_MII.CRS
ETH_MII_RX_CLK: U4.28(RXC) ; port ETH_MII.RX_CLK
ETH_MII_RX_DV: U4.27(RXDV/CRSDV/CONFIG2) ; port ETH_MII.RX_DV
ETH_MII_RX_ER: U4.29(RXER/RX_ER/ISO) ; port ETH_MII.RX_ER
ETH_MII_RXD0: U4.23(RXD0/RXD[0]/RX/DUPLEX) ; port ETH_MII.RXD0
ETH_MII_RXD1: U4.22(RXD1/RXD[1]/PHYAD2) ; port ETH_MII.RXD1
ETH_MII_RXD2: U4.21(RXD2/PHYAD1) ; port ETH_MII.RXD2
ETH_MII_RXD3: U4.20(RXD3/PHYAD0) ; port ETH_MII.RXD3
ETH_MII_TX_CLK: U4.33(TXC) ; port ETH_MII.TX_CLK
ETH_MII_TX_EN: U4.34(TXEN/TX_EN) ; port ETH_MII.TX_EN
ETH_MII_TXD0: U4.35(TXD0/TXD[0]/TX) ; port ETH_MII.TXD0
ETH_MII_TXD1: U4.36(TXD1/TXD[1]/SYNC) ; port ETH_MII.TXD1
ETH_MII_TXD2: U4.38(TXD2) ; port ETH_MII.TXD2
ETH_MII_TXD3: U4.39(TXD3) ; port ETH_MII.TXD3
NetC10_1: C10.1 R4.1 R6.1
NetC11_1: C11.1 R5.1 R7.1
NetC15_2: C15.2 U4.15(XI/REFCLK/CLOCK) Y1.1
NetC16_2: C16.2 U4.14(XO) Y1.2
NetC28_1: C28.1 R13.2 U4.16(REXT)
NetCN3_2: CN3.2(K2) R14.1
NetCN3_3: CN3.3(TD+) R4.2 U4.12(TX+)
NetCN3_4: CN3.4(TD-) R6.2 U4.11(TX-)
NetCN3_7: CN3.7(RD+) R7.2 U4.10(RX+)
NetCN3_8: CN3.8(RD-) R5.2 U4.9(RX-)
NetCN3_11: CN3.11(K1) R15.1
NetR14_2: R14.2 U4.43(LED1/SPEED)
NetR15_2: R15.2 U4.42(LED0/NWAYEN)
NetU4_47: U4.47(~{RST}) ; port PRST

Not connected (* = marked no-connect by the designer): U4 32(INTRP) 44(NC) 45(NC) 46(NC) 48(NC)

### Notes on the sheet
- TITLE
- APVD
- DWN
- CHK
- DWG
- REV
- File:
- Sheet
- of

### Library data of the parts
C10 C11 C17 C20 C23 C24 C31 C34 = C0603: as C5 on sheet yard-ice-toplevel; PN: 000500
C12 C18 C19 C30 = C0805: as C14 on sheet yard-ice-toplevel; PN: 000510
C15 C16 C28 = C0603: SMD Ceramic Chip Capacitor - 0603
  C15 C16: PN: 000515
  C28: PN: 000288
CN3 = J3011G21DNL: 10/100Base-TX surface mount RJ45; MF: Pulse; Package: SMT; PN: 000505
L3 L4 L6 = L0805: as L9 on sheet yard-ice-fpga; PN: 000508
R4-R7 R13-R15 = R0603: SMD Chip Resistor - 0603
  R4-R7: PN: 000095
  R13: PN: 000096
  R14 R15: PN: 000101
U4 = KSZ8041TL: 10Base-T/100Base-TX Physical Layer Transceiver; MF: Micrel; PN: 000516; Package: 48-TQFP
Y1 = ABM3: Miniature Ceramic SMD Crystal; MF: Abracon; MF PN: ABM3-25.000MHZ-B2-T; Package: ABM3; PN: 000522

## Nets that join several sheets
GND: yard-ice-toplevel (20 pins), yard-ice-power (29 pins), yard-ice-fpga (46 pins), yard-ice-ethernet (25 pins)
GND_EARTH: yard-ice-toplevel (CN2.5 CN2.6), yard-ice-power (C1.1), yard-ice-ethernet (CN3.13)
VCC_1.5: yard-ice-power (C35.1 C43.1 L7.2 R18.2), yard-ice-fpga (10 pins)
VCC_3.3: yard-ice-toplevel (6 pins), yard-ice-power (5 pins), yard-ice-fpga (9 pins), yard-ice-ethernet (7 pins)
VCC_4.7: yard-ice-toplevel (C14.1 D6.2 K1.1 U3.6), yard-ice-power (15 pins)
VCC_5V: yard-ice-toplevel (C70.1 U9.5), yard-ice-power (7 pins)
VCC_IO: yard-ice-power (C77.1 Q2.4 R34.1), yard-ice-fpga (5 pins)
NetC5_1: yard-ice-toplevel (C5.1 L1.2), yard-ice-power (D2.1)